# EAGLE design famicom bootleg cart edge v2 (EAGLE 9.6.2)
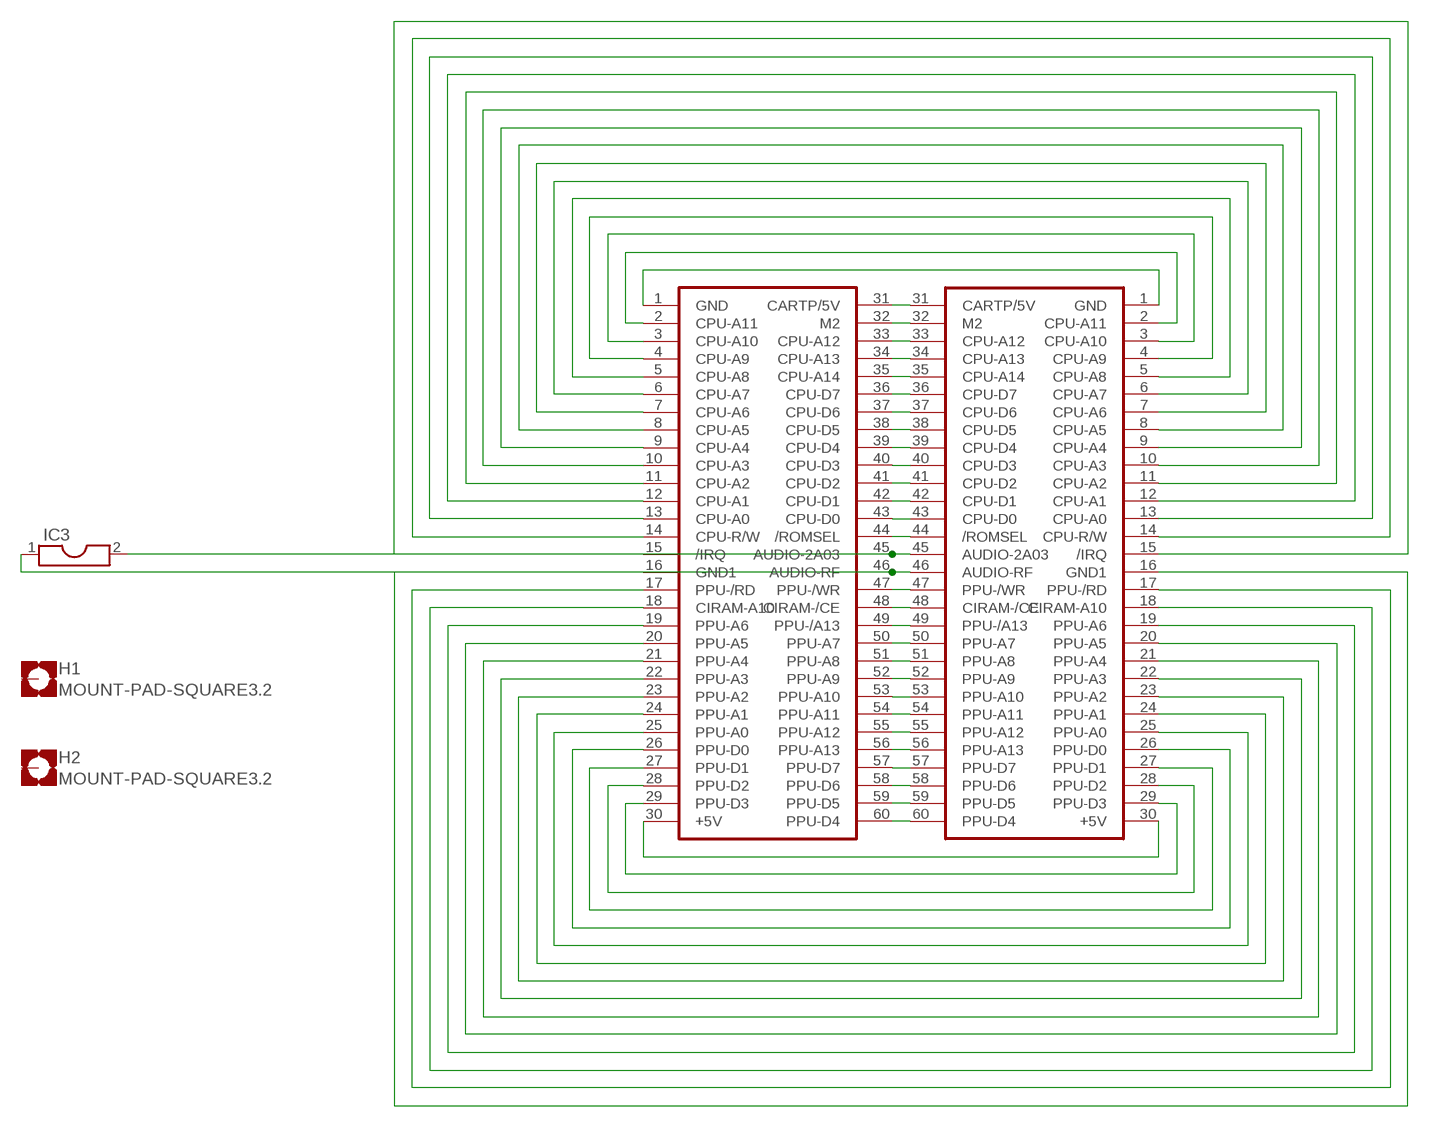
[diagram p0: schematic, sheet 1]

## Parts
H1  MOUNT-PAD-SQUARE3.2  [3,2-PAD-SQUARE]
H2  MOUNT-PAD-SQUARE3.2  [3,2-PAD-SQUARE]
IC1  FAMICOM-CART-EDGE  [DIL60]
IC2  FAMICOM-CART-EDGE  [DIL60]
IC3  DIL2  [DIL02]

## Nets
N$1: IC1.57(PPU-D7) IC2.57(PPU-D7)
N$2: IC1.43(CPU-D0) IC2.43(CPU-D0)
N$3: IC1.34(CPU-A13) IC2.34(CPU-A13)
N$4: IC1.33(CPU-A12) IC2.33(CPU-A12)
N$5: IC1.32(M2) IC2.32(M2)
N$6: IC1.31(CARTP/5V) IC2.31(CARTP/5V)
N$7: IC1.35(CPU-A14) IC2.35(CPU-A14)
N$8: IC1.42(CPU-D1) IC2.42(CPU-D1)
N$9: IC1.41(CPU-D2) IC2.41(CPU-D2)
N$10: IC1.40(CPU-D3) IC2.40(CPU-D3)
N$11: IC1.39(CPU-D4) IC2.39(CPU-D4)
N$12: IC1.38(CPU-D5) IC2.38(CPU-D5)
N$13: IC1.37(CPU-D6) IC2.37(CPU-D6)
N$14: IC1.44(/ROMSEL) IC2.44(/ROMSEL)
N$17: IC1.47(PPU-/WR) IC2.47(PPU-/WR)
N$18: IC1.48(CIRAM-/CE) IC2.48(CIRAM-/CE)
N$19: IC1.36(CPU-D7) IC2.36(CPU-D7)
N$20: IC1.60(PPU-D4) IC2.60(PPU-D4)
N$21: IC1.59(PPU-D5) IC2.59(PPU-D5)
N$22: IC1.58(PPU-D6) IC2.58(PPU-D6)
N$23: IC1.50(PPU-A7) IC2.50(PPU-A7)
N$24: IC1.51(PPU-A8) IC2.51(PPU-A8)
N$25: IC1.52(PPU-A9) IC2.52(PPU-A9)
N$26: IC1.54(PPU-A11) IC2.54(PPU-A11)
N$27: IC1.55(PPU-A12) IC2.55(PPU-A12)
N$28: IC1.56(PPU-A13) IC2.56(PPU-A13)
N$29: IC1.49(PPU-/A13) IC2.49(PPU-/A13)
N$30: IC1.53(PPU-A10) IC2.53(PPU-A10)
N$31: IC1.1(GND) IC2.1(GND)
N$32: IC1.2(CPU-A11) IC2.2(CPU-A11)
N$33: IC1.3(CPU-A10) IC2.3(CPU-A10)
N$34: IC1.4(CPU-A9) IC2.4(CPU-A9)
N$35: IC1.5(CPU-A8) IC2.5(CPU-A8)
N$36: IC1.6(CPU-A7) IC2.6(CPU-A7)
N$37: IC1.7(CPU-A6) IC2.7(CPU-A6)
N$38: IC1.8(CPU-A5) IC2.8(CPU-A5)
N$39: IC1.9(CPU-A4) IC2.9(CPU-A4)
N$40: IC1.10(CPU-A3) IC2.10(CPU-A3)
N$41: IC1.11(CPU-A2) IC2.11(CPU-A2)
N$42: IC1.12(CPU-A1) IC2.12(CPU-A1)
N$43: IC1.13(CPU-A0) IC2.13(CPU-A0)
N$44: IC1.14(CPU-R/W) IC2.14(CPU-R/W)
N$45: IC1.15(/IRQ) IC2.15(/IRQ)
N$46: IC1.30(+5V) IC2.30(+5V)
N$47: IC1.29(PPU-D3) IC2.29(PPU-D3)
N$48: IC1.28(PPU-D2) IC2.28(PPU-D2)
N$49: IC1.27(PPU-D1) IC2.27(PPU-D1)
N$50: IC1.26(PPU-D0) IC2.26(PPU-D0)
N$51: IC1.25(PPU-A0) IC2.25(PPU-A0)
N$52: IC1.24(PPU-A1) IC2.24(PPU-A1)
N$53: IC1.23(PPU-A2) IC2.23(PPU-A2)
N$54: IC1.22(PPU-A3) IC2.22(PPU-A3)
N$55: IC1.21(PPU-A4) IC2.21(PPU-A4)
N$56: IC1.20(PPU-A5) IC2.20(PPU-A5)
N$57: IC1.19(PPU-A6) IC2.19(PPU-A6)
N$58: IC1.18(CIRAM-A10) IC2.18(CIRAM-A10)
N$59: IC1.17(PPU-/RD) IC2.17(PPU-/RD)
N$60: IC1.16(GND1) IC2.16(GND1)
PIN45: IC1.46(AUDIO-RF) IC2.46(AUDIO-RF) IC3.1
PIN46: IC1.45(AUDIO-2A03) IC2.45(AUDIO-2A03) IC3.2
Unconnected: H1.B3,2(MOUNT) H2.B3,2(MOUNT)

## Library data of the parts
H1 H2 = holes:MOUNT-PAD-SQUARE: MOUNTING PAD, square
IC1 IC2 = famicom bootleg mover:FAMICOM-CART-EDGE: MEMORY
IC3 = ic-package:DIL2: Dual In Line

## Board
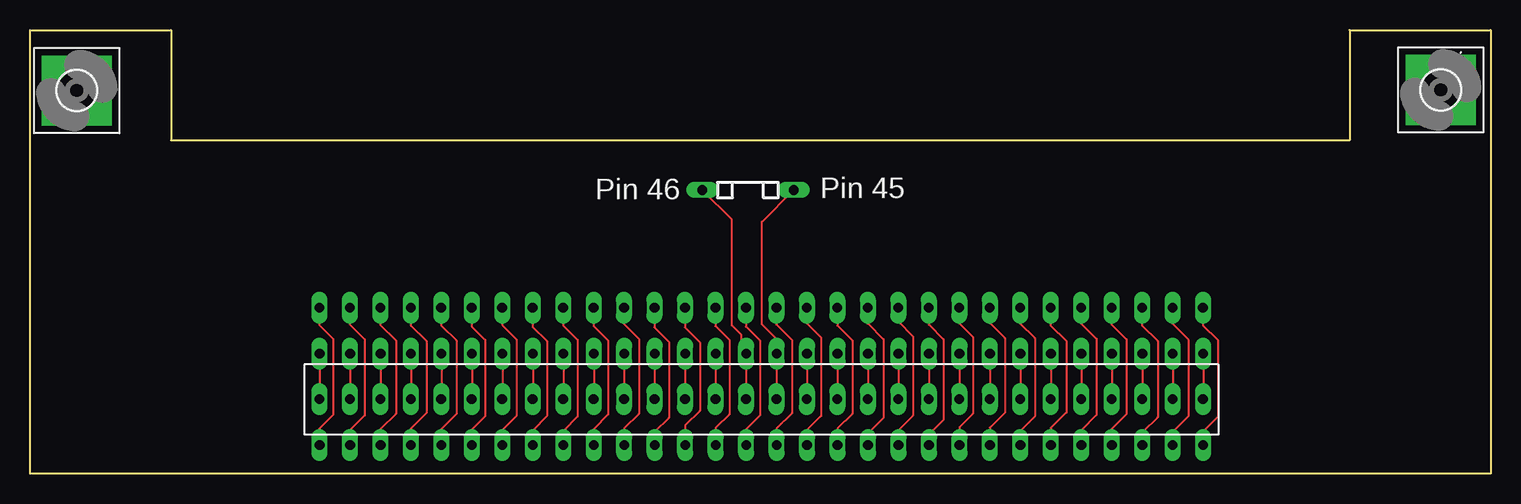
[diagram p1: board, top side]
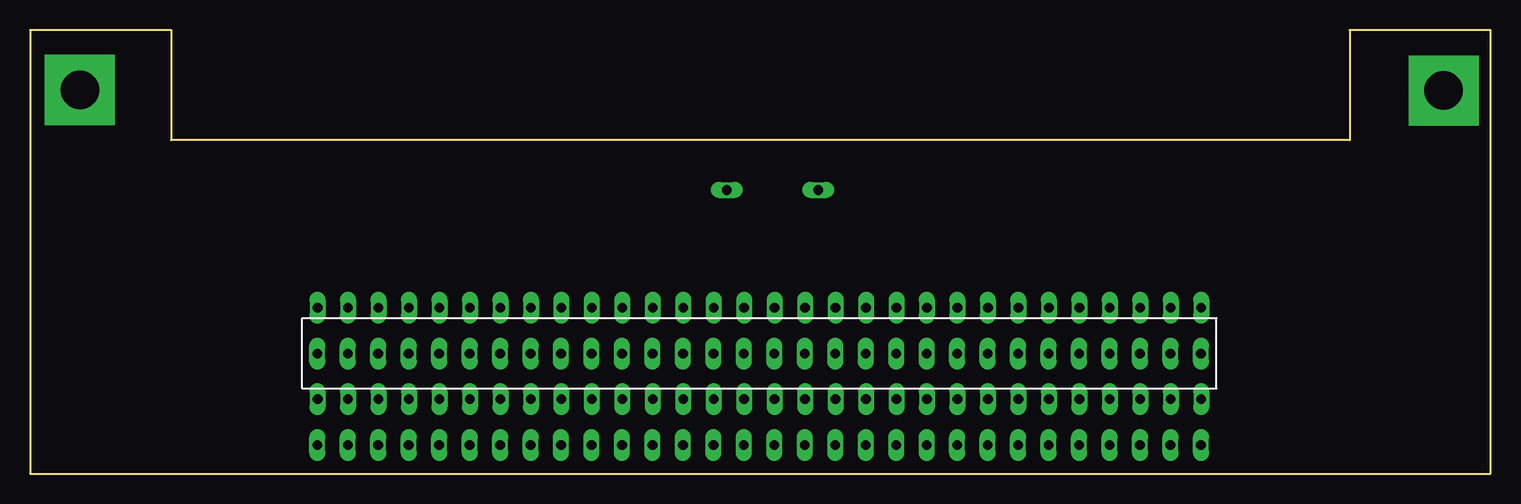
[diagram p2: board, bottom side, seen from below]

Size 121.75 x 37 mm. Coordinates in mm from the lower left corner, seen from the top.
Outline: 0,0 0,37 11.75,37 11.75,27.8 110,27.8 110,37 121.75,37 121.75,0 0,0
Copper layers (1*16): Top 0.035mm / dielectric 1.5mm / Bottom 0.035mm
Design rules "default": minimum track width 6mil, minimum drill 0.35mm, track to track 6mil, track to pad 6mil, pad to pad 6mil, via to via 6mil, smd to smd 6mil, copper to edge 40mil, drill to drill 6mil, minimum pad ring 10mil, minimum via ring 8mil, stop-mask expansion 4mil, vias tented up to drill 0mil, thermal gap 10mil

### Footprints (pad centres in the part's own frame; a part is rotated, then mirrored left to right if it is on the bottom)
3,2-PAD-SQUARE = drill 3.2 pad 5.842 square: B3,2 0,0
DIL60 = drill 0.813 long: 1 -11.43,-3.81; 2 -8.89,-3.81; 3 -6.35,-3.81; 4 -3.81,-3.81; 5 -1.27,-3.81; 6 1.27,-3.81; 7 3.81,-3.81; 8 6.35,-3.81; 9 8.89,-3.81; 10 11.43,-3.81; 11 13.97,-3.81; 12 16.51,-3.81; 13 19.05,-3.81; 14 21.59,-3.81; 15 24.13,-3.81; 16 26.67,-3.81; 17 29.21,-3.81; 18 31.75,-3.81; 19 34.29,-3.81; 20 36.83,-3.81; 21 39.37,-3.81; 22 41.91,-3.81; 23 44.45,-3.81; 24 46.99,-3.81; 25 49.53,-3.81; 26 52.07,-3.81; 27 54.61,-3.81; 28 57.15,-3.81; 29 59.69,-3.81; 30 62.23,-3.81; 31 -11.43,3.81; 32 -8.89,3.81; 33 -6.35,3.81; 34 -3.81,3.81; 35 -1.27,3.81; 36 1.27,3.81; 37 3.81,3.81; 38 6.35,3.81; 39 8.89,3.81; 40 11.43,3.81; 41 13.97,3.81; 42 16.51,3.81; 43 19.05,3.81; 44 21.59,3.81; 45 24.13,3.81; 46 26.67,3.81; 47 29.21,3.81; 48 31.75,3.81; 49 34.29,3.81; 50 36.83,3.81; 51 39.37,3.81; 52 41.91,3.81; 53 44.45,3.81; 54 46.99,3.81; 55 49.53,3.81; 56 52.07,3.81; 57 54.61,3.81; 58 57.15,3.81; 59 59.69,3.81; 60 62.23,3.81
DIL02 = drill 0.813 long: 1 0,-3.81; 2 0,3.81

### Placement (x,y rotation side)
H1  117.6,32 0 top
H2  3.9,31.95 0 top
IC1  35.55,10.02 180 bottom
IC2  35.57,6.18 0 top
IC3  59.85,23.65 90 top

### Tracks (layer width: path | path; a pad name or v marks a point on that pad's centre or on a via)
N$1
  Top 0.152: IC2.57 90.18,6.23 IC1.57
N$2
  Top 0.152: IC2.43 54.62,6.23 IC1.43
N$3
  Top 0.152: IC2.34 31.76,6.23 IC1.34
N$4
  Top 0.152: IC2.33 29.22,6.23 IC1.33
N$5
  Top 0.152: IC2.32 26.68,6.23 IC1.32
N$6
  Top 0.152: IC2.31 24.14,6.23 IC1.31
N$7
  Top 0.152: IC2.35 34.3,6.23 IC1.35
N$8
  Top 0.152: IC2.42 52.08,6.23 IC1.42
N$9
  Top 0.152: IC2.41 49.54,6.23 IC1.41
N$10
  Top 0.152: IC2.40 47,6.23 IC1.40
N$11
  Top 0.152: IC2.39 44.46,6.23 IC1.39
N$12
  Top 0.152: IC2.38 41.92,6.23 IC1.38
N$13
  Top 0.152: IC2.37 39.38,6.23 IC1.37
N$14
  Top 0.152: IC2.44 57.16,6.23 IC1.44
N$17
  Top 0.152: IC2.47 64.78,6.23 IC1.47
N$18
  Top 0.152: IC2.48 67.32,6.23 IC1.48
N$19
  Top 0.152: IC2.36 36.84,6.23 IC1.36
N$20
  Top 0.152: IC2.60 97.8,6.23 IC1.60
N$21
  Top 0.152: IC2.59 95.26,6.23 IC1.59
N$22
  Top 0.152: IC2.58 92.72,6.23 IC1.58
N$23
  Top 0.152: IC2.50 72.4,6.23 IC1.50
N$24
  Top 0.152: IC2.51 74.94,6.23 IC1.51
N$25
  Top 0.152: IC2.52 77.48,6.23 IC1.52
N$26
  Top 0.152: IC2.54 82.56,6.23 IC1.54
N$27
  Top 0.152: IC2.55 85.1,6.23 IC1.55
N$28
  Top 0.152: IC2.56 87.64,6.23 IC1.56
N$29
  Top 0.152: IC2.49 69.86,6.23 IC1.49
N$30
  Top 0.152: IC2.53 80.02,6.23 IC1.53
N$31
  Top 0.152: IC1.1 24.12,12.38 25.25,11.25 25.25,4.88 24.14,3.77 IC2.1
N$32
  Top 0.152: IC1.2 26.66,12.44 27.9,11.2 27.9,4.85 26.68,3.63 IC2.2
N$33
  Top 0.152: IC1.3 29.2,12.4 30.5,11.1 30.5,5 29.22,3.72 IC2.3
N$34
  Top 0.152: IC1.4 31.74,12.36 33.05,11.05 33.05,5.05 31.76,3.76 IC2.4
N$35
  Top 0.152: IC1.5 34.28,12.37 35.55,11.1 35.55,4.97 34.3,3.72 IC2.5
N$36
  Top 0.152: IC1.6 36.82,12.28 37.95,11.15 37.95,4.78 36.84,3.67 IC2.6
N$37
  Top 0.152: IC1.7 39.36,12.39 40.55,11.2 40.55,4.8 39.38,3.63 IC2.7
N$38
  Top 0.152: IC1.8 41.9,12.25 43.1,11.05 43.1,4.8 41.92,3.62 IC2.8
N$39
  Top 0.152: IC1.9 44.44,12.36 45.65,11.15 45.65,4.76 44.46,3.57 IC2.9
N$40
  Top 0.152: IC1.10 46.98,12.32 48.2,11.1 48.2,4.92 47,3.72 IC2.10
N$41
  Top 0.152: IC1.11 49.52,12.48 50.75,11.25 50.75,4.98 49.54,3.77 IC2.11
N$42
  Top 0.152: IC1.12 52.06,12.19 53.25,11 53.25,4.65 52.08,3.48 IC2.12
N$43
  Top 0.152: IC1.13 54.6,12.2 55.85,10.95 55.85,5.25 54.62,4.02 IC2.13
N$44
  Top 0.152: IC1.14 57.14,12.31 58.3,11.15 58.3,4.95 57.16,3.81 IC2.14
N$45
  Top 0.152: IC1.15 59.68,12.27 60.85,11.1 60.85,4.85 59.7,3.7 IC2.15
N$46
  Top 0.152: IC1.30 97.78,12.37 99,11.15 99,4.72 97.8,3.52 IC2.30
N$47
  Top 0.152: IC1.29 95.24,12.51 96.55,11.2 96.55,4.76 95.26,3.47 IC2.29
N$48
  Top 0.152: IC1.28 92.7,12.35 94,11.05 94,4.7 92.72,3.42 IC2.28
N$49
  Top 0.152: IC1.27 90.16,12.44 91.4,11.2 91.4,4.94 90.18,3.72 IC2.27
N$50
  Top 0.152: IC1.26 87.62,12.53 88.9,11.25 88.9,4.88 87.64,3.62 IC2.26
N$51
  Top 0.152: IC1.25 85.08,12.37 86.4,11.05 86.4,5.1 85.1,3.8 IC2.25
N$52
  Top 0.152: IC1.24 82.54,12.51 83.75,11.3 83.75,4.76 82.56,3.57 IC2.24
N$53
  Top 0.152: IC1.23 80,12.55 81.25,11.3 81.25,5.05 80.02,3.82 IC2.23
N$54
  Top 0.152: IC1.22 77.46,12.54 78.6,11.4 78.6,4.99 77.48,3.87 IC2.22
N$55
  Top 0.152: IC1.21 74.92,12.43 76.15,11.2 76.15,4.5 74.94,3.29 IC2.21
N$56
  Top 0.152: IC1.20 72.38,12.67 73.6,11.45 73.6,4.82 72.4,3.62 IC2.20
N$57
  Top 0.152: IC1.19 69.84,12.51 71.15,11.2 71.15,4.65 69.86,3.36 IC2.19
N$58
  Top 0.152: IC1.18 67.3,12.35 68.55,11.1 68.55,5 67.32,3.77 IC2.18
N$59
  Top 0.152: IC1.17 64.76,12.54 65.95,11.35 65.95,4.8 64.78,3.63 IC2.17
N$60
  Top 0.152: IC1.16 62.22,12.43 63.5,11.15 63.5,5.03 62.24,3.77 IC2.16
PIN45
  Top 0.152: IC1.46 62.24,6.23 IC2.46 62.24,11.21 61,12.45 61,19.1 61,19.3 61,20.99 IC3.1
PIN46
  Top 0.152: IC1.45 59.7,6.23 IC2.45 59.3,10.39 59.3,11.55 58.5,12.35 58.5,21.19 IC3.2

### Text on the board
tNames: Pin 46 | Pin 45